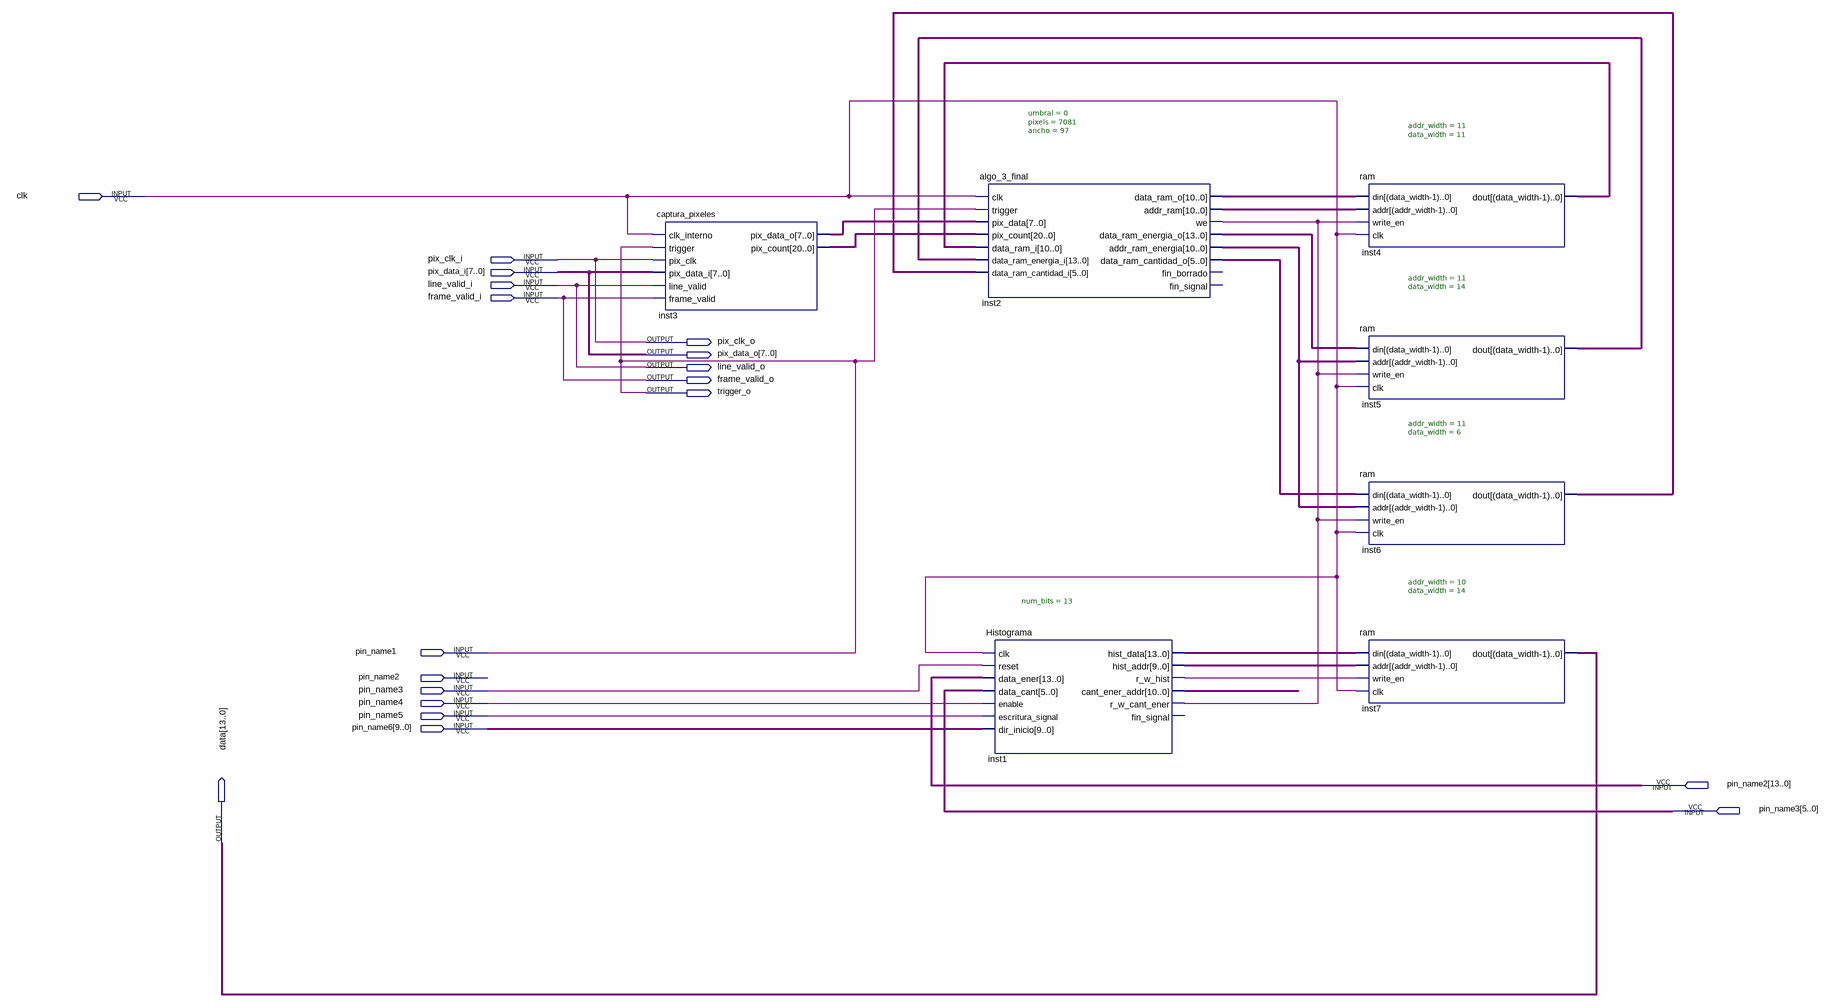
[diagram p0: schematic sheet]
// Quartus schematic test_sistema_completo.bdf as structural Verilog: 7 symbols, 19 pins
module test_sistema_completo (
  input  clk,
  input  pix_clk_i,
  input  [7:0] pix_data_i,
  input  line_valid_i,
  input  frame_valid_i,
  input  pin_name1,
  input  pin_name2_1bit,
  input  pin_name3_1bit,
  input  pin_name4,
  input  pin_name5,
  input  [9:0] pin_name6,
  input  [13:0] pin_name2,
  input  [5:0] pin_name3,
  output pix_clk_o,
  output [7:0] pix_data_o,
  output line_valid_o,
  output frame_valid_o,
  output trigger_o,
  output [13:0] data
);

  wire inst1_r_w_hist, inst2_we;
  wire [5:0] inst2_data_ram_cantidad_o, inst6_dout;
  wire [7:0] inst3_pix_data_o;
  wire [9:0] inst1_hist_addr;
  wire [10:0] inst1_cant_ener_addr, inst2_addr_ram, inst2_addr_ram_energia, inst2_data_ram_o, inst4_dout;
  wire [13:0] inst1_hist_data, inst2_data_ram_energia_o, inst5_dout;
  wire [20:0] inst3_pix_count;

  captura_pixeles inst3 (
    .clk_interno(clk), .trigger(pin_name1), .pix_clk(pix_clk_i), .pix_data_i(pix_data_i),
    .line_valid(line_valid_i), .frame_valid(frame_valid_i), .pix_data_o(inst3_pix_data_o),
    .pix_count(inst3_pix_count));
  algo_3_final #(.umbral(0), .pixels(7081), .ancho(97)) inst2 (
    .clk(clk), .trigger(pin_name1), .pix_data(inst3_pix_data_o), .pix_count(inst3_pix_count),
    .data_ram_i(inst4_dout), .data_ram_energia_i(inst5_dout), .data_ram_cantidad_i(inst6_dout),
    .data_ram_o(inst2_data_ram_o), .addr_ram(inst2_addr_ram), .we(inst2_we),
    .data_ram_energia_o(inst2_data_ram_energia_o), .addr_ram_energia(inst2_addr_ram_energia),
    .data_ram_cantidad_o(inst2_data_ram_cantidad_o));  // open: fin_borrado, fin_signal
  Histograma #(.num_bits(13)) inst1 (
    .clk(clk), .reset(pin_name3_1bit), .data_ener(pin_name2), .data_cant(pin_name3), .enable(pin_name4),
    .escritura_signal(pin_name5), .dir_inicio(pin_name6), .hist_data(inst1_hist_data),
    .hist_addr(inst1_hist_addr), .r_w_hist(inst1_r_w_hist), .cant_ener_addr(inst1_cant_ener_addr),
    .r_w_cant_ener(inst2_we));  // open: fin_signal
  ram #(.addr_width(11), .data_width(11)) inst4 (
    .din(inst2_data_ram_o), .addr(inst2_addr_ram), .write_en(inst2_we), .clk(clk), .dout(inst4_dout));
  ram #(.addr_width(11), .data_width(14)) inst5 (
    .din(inst2_data_ram_energia_o), .addr(inst2_addr_ram_energia), .write_en(inst2_we), .clk(clk),
    .dout(inst5_dout));
  ram #(.addr_width(11), .data_width(6)) inst6 (
    .din(inst2_data_ram_cantidad_o), .addr(inst2_addr_ram_energia), .write_en(inst2_we), .clk(clk),
    .dout(inst6_dout));
  ram #(.addr_width(10), .data_width(14)) inst7 (
    .din(inst1_hist_data), .addr(inst1_hist_addr), .write_en(inst1_r_w_hist), .clk(clk), .dout(data));

  assign frame_valid_o = frame_valid_i;
  assign line_valid_o = line_valid_i;
  assign pix_clk_o = pix_clk_i;
  assign pix_data_o = pix_data_i;
  assign trigger_o = pin_name1;
endmodule
